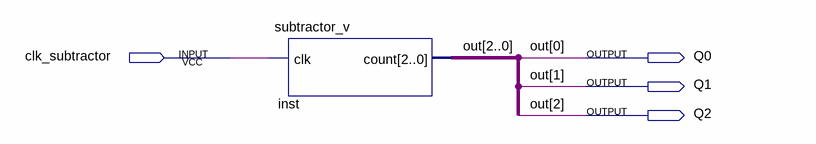
[diagram p0: schematic sheet]
// Quartus schematic Subtractor.bdf as structural Verilog: 1 symbols, 4 pins
module Subtractor (
  input  clk_subtractor,
  output Q0,
  output Q1,
  output Q2
);

  subtractor_v inst (.clk(clk_subtractor), .count({Q2, Q1, Q0}));

  // Other names for the same wires on the sheet: out[2:0] = {Q2, Q1, Q0}
endmodule
